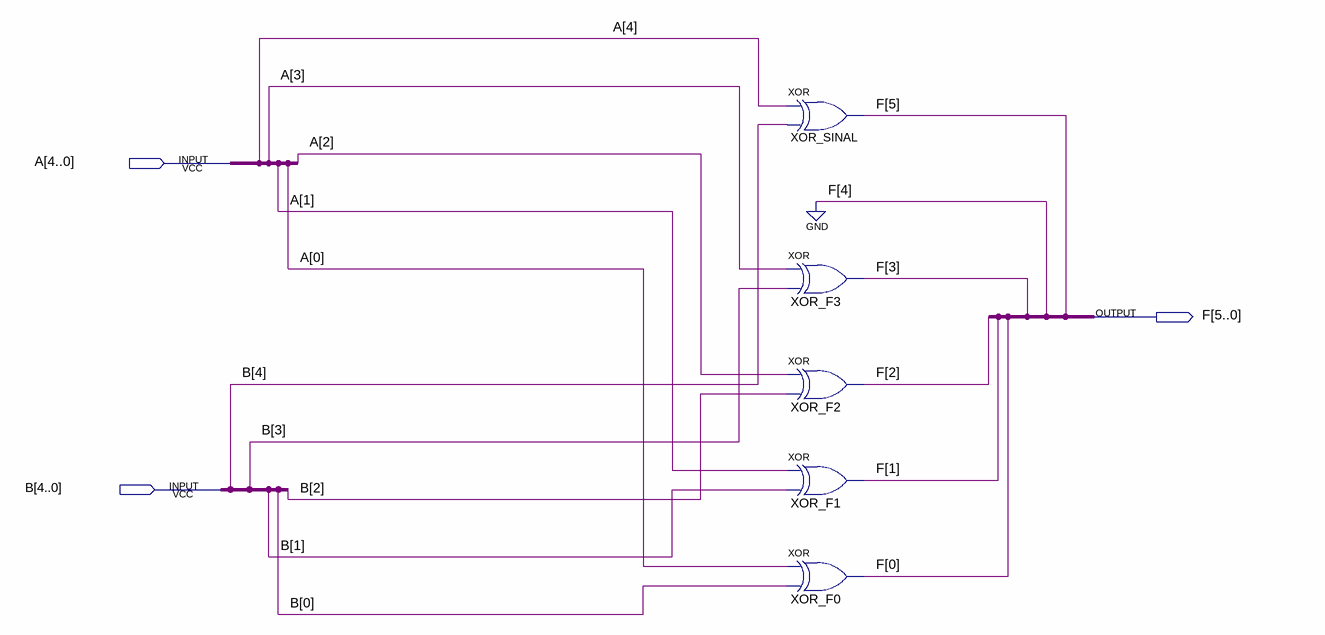
[diagram p0: schematic sheet]
// Quartus schematic CircuitoXOR.bdf as structural Verilog: 5 symbols, 3 pins
module CircuitoXOR (
  input  [4:0] A,
  input  [4:0] B,
  output [5:0] F
);

  xor XOR_SINAL (F[5], A[4], B[4]);
  xor XOR_F3 (F[3], A[3], B[3]);
  xor XOR_F2 (F[2], A[2], B[2]);
  xor XOR_F1 (F[1], A[1], B[1]);
  xor XOR_F0 (F[0], A[0], B[0]);

  assign F[4] = 1'b0;
endmodule
